# Altium schematic sheet extpart.SchDoc
size A4
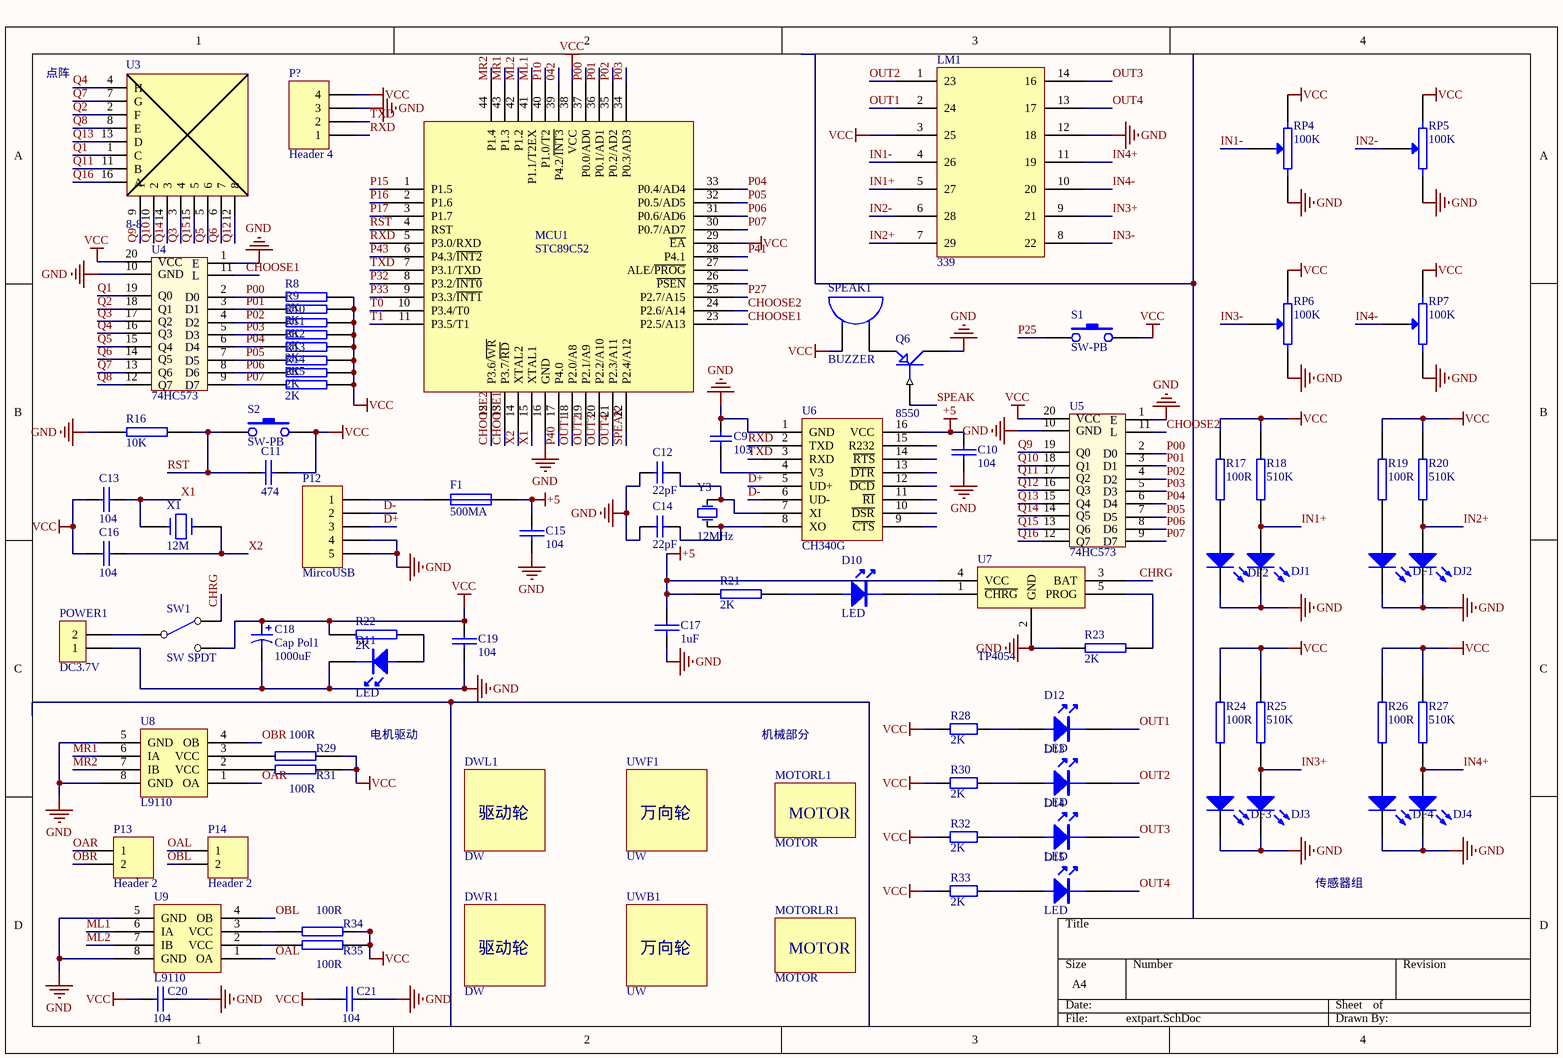
[diagram p0: extpart.SchDoc]

## Parts
C9  value 103  [C-RAD-0805]  (hidden comment: Cap)
C10  104  [0805C]
C11  474  [0805C]
C12  value 22pF  [C-RAD-0805]  (hidden comment: Cap)
C13  104  [0805C]
C14  value 22pF  [C-RAD-0805]  (hidden comment: Cap)
C15  104  [0805C]
C16  104  [0805C]
C17  1uF  [0805C]
C18  Cap Pol1  value 1000uF  [RB7.6-15]
C19  104  [0805C]
C20  104  [0805C]
C21  104  [0805C]
D10  LED  [0805D]
D11  LED  [0805D]
D12  LED  [0805D]
D13  LED  [0805D]
D14  LED  [0805D]
D15  LED  [0805D]
DF1  LED0  [LED3]  (value not drawn)
DF2  LED0  [LED3]  (value not drawn)
DF3  LED0  [LED3]  (value not drawn)
DF4  LED0  [LED3]  (value not drawn)
DJ1  LED0  [LED3]  (value not drawn)
DJ2  LED0  [LED3]  (value not drawn)
DJ3  LED0  [LED3]  (value not drawn)
DJ4  LED0  [LED3]  (value not drawn)
DWL1  DW  [DW]
DWR1  DW  [DW]
F1  500MA  [0805R]
LM1  339  [SOP-14]
MCU1  STC89C52  [TQFP-44]
MOTORL1  MOTOR  [MOTOR]
MOTORLR1  MOTOR  [MOTOR]
P12  MircoUSB  [MircoUSB]
P13  Header 2  [HDR1X2]
P14  Header 2  [HDR1X2]
P?  Header 4  [HDR1X4]
POWER1  DC3.7V  [XH2.54-2P]
Q6  8550  [SOT-23-P]
R8  2K  [0805R]
R9  2K  [0805R]
R10  2K  [0805R]
R11  2K  [0805R]
R12  2K  [0805R]
R13  2K  [0805R]
R14  2K  [0805R]
R15  2K  [0805R]
R16  10K  [0805R]
R17  100R  [0805R]
R18  510K  [0805R]
R19  100R  [0805R]
R20  510K  [0805R]
R21  2K  [0805R]
R22  2K  [0805R]
R23  2K  [0805R]
R24  100R  [0805R]
R25  510K  [0805R]
R26  100R  [0805R]
R27  510K  [0805R]
R28  value 2K  [0805-1]  (hidden comment: Res1)
R29  100R  [0805R]
R30  value 2K  [0805-1]  (hidden comment: Res1)
R31  100R  [0805R]
R32  value 2K  [0805-1]  (hidden comment: Res1)
R33  value 2K  [0805-1]  (hidden comment: Res1)
R34  100R  [0805R]
R35  100R  [0805R]
RP4  100K  [VR-5]
RP5  100K  [VR-5]
RP6  100K  [VR-5]
RP7  100K  [VR-5]
S1  SW-PB  [SWITCH]
S2  SW-PB  [SWITCH]
SPEAK1  BUZZER  [BUZZ]
SW1  SW SPDT  [SW-1-2]
U3  8-8  [8-8点阵 - duplicate]
U4  74HC573  [SOP-20（1.27）]
U5  74HC573  [SOP-20（1.27）]
U6  CH340G  [SOP-16]
U7  TP4054  [SOT-23-5]
U8  L9110  [SO-8]
U9  L9110  [SO-8]
UWB1  UW  [UW]
UWF1  UW  [UW]
X1  12M  [XTAL2]
Y3  value 12MHz  [XTAL1]  (hidden comment: XTAL)

## Nets
+5: C10.1 C15.1 C17.1 F1.2 R21.1 U6.16(VCC) U7.4(VCC)
GND: C9.2 C10.2 C12.1 C14.1 C15.2 C17.2 C18.2 C19.2 C20.2 C21.2 D11.2 DF1.K DF2.K DF3.K DF4.K DJ1.K DJ2.K DJ3.K DJ4.K LM1.12(18) MCU1.16(GND) P12.4 P12.5 P?.3 POWER1.1 Q6.3(C) R16.1 R23.1 RP4.1 RP5.1 RP6.1 RP7.1 U4.1(E) U4.10(GND) U5.1(E) U5.10(GND) U6.1(GND) U7.2(GND) U8.5(GND) U8.8(GND) U9.5(GND) U9.8(GND)
VCC: C11.2 C13.2 C16.1 C18.1 C19.1 C20.1 C21.1 LM1.3(25) MCU1.29(~{EA}) MCU1.38(VCC) P?.4 R8.2 R9.2 R10.2 R11.2 R12.2 R13.2 R14.2 R15.2 R17.2 R18.2 R19.2 R20.2 R22.1 R24.2 R25.2 R26.2 R27.2 R28.1 R29.2 R30.1 R31.2 R32.1 R33.1 R34.2 R35.2 RP4.3 RP5.3 RP6.3 RP7.3 S1.2 S2.2 SPEAK1.1(A) SW1.3(NO) U4.20(VCC) U5.20(VCC)
042: MCU1.39(P4.2/~{INT3})
CHOOSE1: MCU1.13(P3.7/~{RD}) MCU1.23(P2.5/A13) U4.11(L)
CHOOSE2: MCU1.12(P3.6/~{WR}) MCU1.24(P2.6/A14) U5.11(L)
CHRG: SW1.2(NC) U7.3(BAT)
D+: P12.3 U6.5(UD+)
D-: P12.2 U6.6(UD-)
IN1+: DJ1.A LM1.5(27) R18.1
IN1-: LM1.4(26) RP4.2(W)
IN2+: DJ2.A LM1.7(29) R20.1
IN2-: LM1.6(28) RP5.2(W)
IN3+: DJ3.A LM1.9(21) R25.1
IN3-: LM1.8(22) RP6.2(W)
IN4+: DJ4.A LM1.11(19) R27.1
IN4-: LM1.10(20) RP7.2(W)
ML1: MCU1.41(P1.1/T2EX) U9.6(IA)
ML2: MCU1.42(P1.2) U9.7(IB)
MR1: MCU1.43(P1.3) U8.6(IA)
MR2: MCU1.44(P1.4) U8.7(IB)
OAL: P14.1 U9.1(OA)
OAR: P13.1 U8.1(OA)
OBL: P14.2 U9.4(OB)
OBR: P13.2 U8.4(OB)
OUT1: D12.2 LM1.2(24) MCU1.18(P2.0/A8)
OUT2: D13.2 LM1.1(23) MCU1.19(P2.1/A9)
OUT3: D14.2 LM1.14(16) MCU1.20(P2.2/A10)
OUT4: D15.2 LM1.13(17) MCU1.21(P2.3/A11)
P00: MCU1.37(P0.0/AD0) R8.1 U4.2(D0) U5.2(D0)
P01: MCU1.36(P0.1/AD1) R9.1 U4.3(D1) U5.3(D1)
P02: MCU1.35(P0.2/AD2) R10.1 U4.4(D2) U5.4(D2)
P03: MCU1.34(P0.3/AD3) R11.1 U4.5(D3) U5.5(D3)
P04: MCU1.33(P0.4/AD4) R12.1 U4.6(D4) U5.6(D4)
P05: MCU1.32(P0.5/AD5) R13.1 U4.7(D5) U5.7(D5)
P06: MCU1.31(P0.6/AD6) R14.1 U4.8(D6) U5.8(D6)
P07: MCU1.30(P0.7/AD7) R15.1 U4.9(D7) U5.9(D7)
P10: MCU1.40(P1.0/T2)
P15: MCU1.1(P1.5)
P16: MCU1.2(P1.6)
P17: MCU1.3(P1.7)
P25: S1.1
P27: MCU1.25(P2.7/A15)
P32: MCU1.8(P3.2/~{INT0})
P33: MCU1.9(P3.3/~{INT1})
P40: MCU1.17(P4.0)
P41: MCU1.28(P4.1)
P43: MCU1.6(P4.3/~{INT2})
Q1: U3.1(C) U4.19(Q0)
Q2: U3.2(F) U4.18(Q1)
Q3: U3.3(4) U4.17(Q2)
Q4: U3.4(H) U4.16(Q3)
Q5: U3.5(6) U4.15(Q4)
Q6: U3.6(7) U4.14(Q5)
Q7: U3.7(G) U4.13(Q6)
Q8: U3.8(E) U4.12(Q7)
Q9: U3.9(1) U5.19(Q0)
Q10: U3.10(2) U5.18(Q1)
Q11: U3.11(B) U5.17(Q2)
Q12: U3.12(8) U5.16(Q3)
Q13: U3.13(D) U5.15(Q4)
Q14: U3.14(3) U5.14(Q5)
Q15: U3.15(5) U5.13(Q6)
Q16: U3.16(A) U5.12(Q7)
RST: C11.1 MCU1.4(RST) R16.2 S2.1
RXD: MCU1.5(P3.0/RXD) P?.1 U6.2(TXD)
SPEAK: MCU1.22(P2.4/A12) Q6.1(B)
T0: MCU1.10(P3.4/T0)
T1: MCU1.11(P3.5/T1)
TXD: MCU1.7(P3.1/TXD) P?.2 U6.3(RXD)
X1: C13.1 MCU1.15(XTAL1) X1.2
X2: C16.2 MCU1.14(XTAL2) X1.1
NetC9_1: C9.1 U6.4(V3)
NetC12_2: C12.2 U6.7(XI) Y3.2(OSC2)
NetC14_2: C14.2 U6.8(XO) Y3.1(OSC1)
NetD10_1: D10.1 R21.2
NetD10_2: D10.2 U7.1(~{CHRG})
NetD11_1: D11.1 R22.2
NetD12_1: D12.1 R28.2
NetD13_1: D13.1 R30.2
NetD14_1: D14.1 R32.2
NetD15_1: D15.1 R33.2
NetDF1_A: DF1.A R19.1
NetDF2_A: DF2.A R17.1
NetDF3_A: DF3.A R24.1
NetDF4_A: DF4.A R26.1
NetF1_1: F1.1 P12.1
NetPOWER1_2: POWER1.2 SW1.1(COMMON)
NetQ6_2: Q6.2(E) SPEAK1.2(B)
NetR23_2: R23.2 U7.5(PROG)
NetR29_1: R29.1 U8.3(VCC)
NetR31_1: R31.1 U8.2(VCC)
NetR34_1: R34.1 U9.3(VCC)
NetR35_1: R35.1 U9.2(VCC)

Not connected (* = marked no-connect by the designer): MCU1 26(~{PSEN}) 27(ALE/~{PROG}); U6 9(~{CTS}) 10(~{DSR}) 11(~{RI}) 12(~{DCD}) 13(~{DTR}) 14(~{RTS}) 15(R232)

## Notes on the sheet
- 点阵
- 电机驱动
- (near MOTORL1) 机械部分
- 传感器组
- (in symbol DW) 驱动轮
- (in symbol UW) 万向轮

## Library data of the parts
C9 C12 C14 = Cap: 无极性电容; Published: 8-Jun-2000; LatestRevisionDate: 17-Jul-2002; LatestRevisionNote: Re-released for DXP Platform.; PackageReference: RAD-0.3; Publisher: Altium Limited
C10 C11 C13 C15-C17 C19-C21 = CAP: Capacitor
C18 = Cap Pol1: Polarized Capacitor (Radial); Published: 8-Jun-2000; LatestRevisionDate: 17-Jul-2002; LatestRevisionNote: Re-released for DXP Platform.; PackageReference: RB7.6-15; Publisher: Altium Limited; PackageDescription: Polarized Capacitor (Radial); 2 Leads
DF1-DF4 DJ1-DJ4 = LED0: 发光二极管; Published: 8-Jun-2000; LatestRevisionDate: 08-Jul-2005; LatestRevisionNote: Mech Layer 1 removed.; PackageReference: LED-0; Publisher: Altium Limited
DWL1 DWR1 = DW: driving wheel
F1 = FUSE1: Fuse
LM1 = Component_1
MCU1 = STC89C52RC-PQFP: MCU
P12 = Header 5: 5PIN
P13 P14 = Header 2: Header, 2-Pin; LatestRevisionDate: 17-Jul-2002; LatestRevisionNote: Re-released for DXP Platform.; Publisher: Altium Limited
P? = Header 4: Header, 4-Pin; LatestRevisionDate: 17-Jul-2002; LatestRevisionNote: Re-released for DXP Platform.; Publisher: Altium Limited
POWER1 = CON2: Connector
Q6 = PNP1: PNP Transistor
R8-R27 R29 R31 R34 R35 = RES2
R28 R30 R32 R33 = Res1: 贴片电阻; Published: 8-Jun-2000; LatestRevisionDate: 17-Jul-2002; LatestRevisionNote: Re-released for DXP Platform.; PackageReference: AXIAL-0.4; Publisher: Altium Limited
RP4-RP7 = POT2: Potentiometer
U3 = 8-8点阵: 8-8: RAD
U6 = CH340G: USB-SERIAL
UWB1 UWF1 = UW: universal wheel
X1 = CRYSTAL
Y3 = XTAL: 晶振; Published: 8-Jun-2000; LatestRevisionDate: 17-Jul-2002; LatestRevisionNote: Re-released for DXP Platform.; PackageReference: R38; Publisher: Altium Limited